# Altium project Analog_Project.PrjPcb (part 2 of 2)
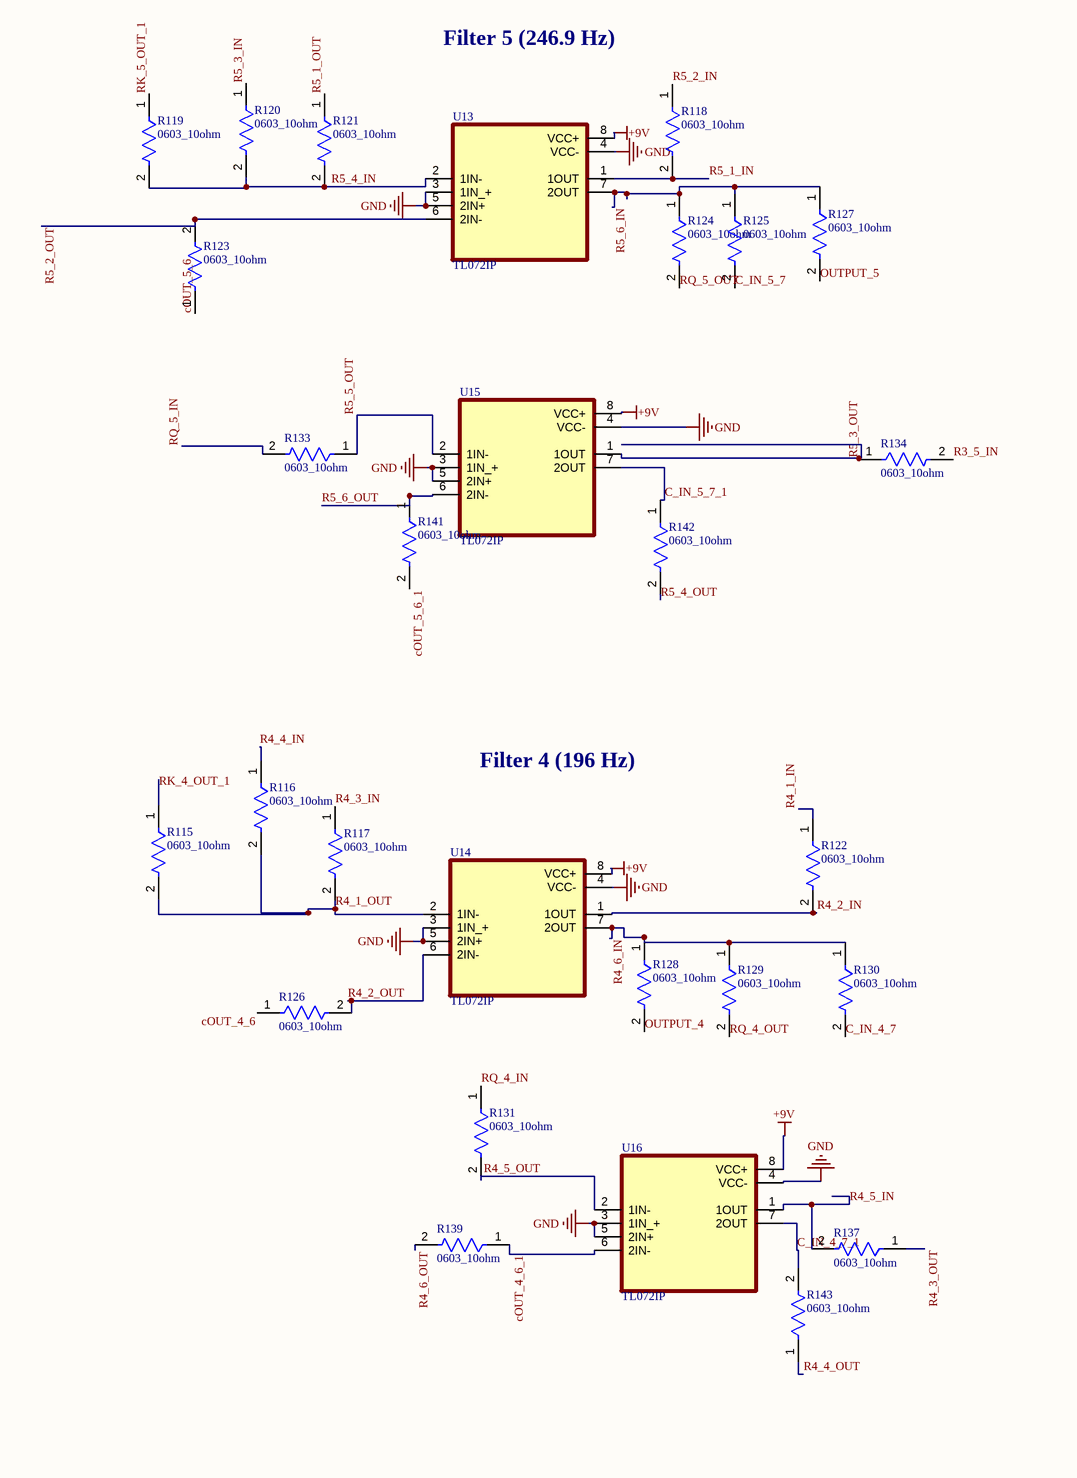
[diagram p6: Sheet1.SchDoc, bottom right]

## Sheet Sheet1.SchDoc (continued)

### Library data of the parts
C1 C15 C30 C31 C36 C76 C77 C82 = CMP-2007-04523-1: Manufacturer: AVX Interconnect / Elco; Part Number: 0805ZG106ZAT2A
C2 = CMP-2007-01614-1: Manufacturer: Vitramon; Part Number: VJ0805G225MXQTW1BC
C3 C4 C19-C21 C24 C26 C27 C32 C33 C37 C39 C40 C65-C67 C70 C72 C73 C78 C79 C83 C85 C86 = CMP-1036-04417-1: CAP 100nF 50V ±5% 0805 (2012 Metric) Thickness 1.45mm SMD; Case-Metric: 2012; Tolerance: Â±5%; Case-EIA: 0805; Max Thickness: 1.45 mm; Rated Voltage: 50 V; Value: 100nF; Technology: SMT
C5-C7 = CMP-2007-03159-1: Manufacturer: Vitramon; Part Number: VJ0805Y103KXAMP
C8 = CMP-03020-034662-1: CAP CER 10UF 10V X7R 0805; Tolerance: 10%; Case/Package: 0805; Ratings: AEC-Q200; Packaging: Tape and Reel; Voltage Rating: 10V; Max Operating Temperature: 125°C; Min Operating Temperature: -55°C; Case Code (Metric): 2012; Case Code (Imperial): 0805; Mount: Surface Mount; RoHS Compliant: Yes
C9-C14 C25 C29 C35 C38 C71 C75 C81 C84 = CMP-2007-01676-1: Manufacturer: Vitramon; Part Number: VJ0805Y105KXQRW1BC
C16 C22 C23 C28 C41 C68 C69 C74 C87 = CMP-2007-04758-1: Manufacturer: AVX Interconnect / Elco; Part Number: 08053C334MAT2A
C17 = CMP-03422-001497-1: CAP CER 22UF 25V X5R 0805; Tolerance: 20%; Max Operating Temperature: 85°C; Dielectric: X5R; Termination: SMD/SMT; Voltage Rating: 25V; Width: 0.049inch; Min Operating Temperature: -55°C; Case/Package: 0805; Lead Free: Lead Free; RoHS Compliant: Yes; Weight: 0.000194oz; Voltage Rating (DC): 25V; Length: 0.079inch; Halogen Free: Halogen Free; Height: 1.25mm; Packaging: Tape and Reel; Package Quantity: 3000; Case Code (Metric): 2012; Thickness: 0.057inch; Case Code (Imperial): 0805; Mount: Surface Mount
C18 = CMP-06035-033356-1: Chip Multilayer Ceramic Capacitors for General Purpose, 0805, 100uF, X5R, 15%, 20%, 4V; Length: 0.079inch; Voltage Rating (DC): 4V; Min Operating Temperature: -55°C; Dielectric: X5R; Case Code (Metric): 2012; Case/Package: 0805; Voltage Rating: 4V; Width: 0.049inch; Case Code (Imperial): 0805; Mount: Surface Mount; Packaging: Tape and Reel; Thickness: 0.057inch; Tolerance: 20%; Max Operating Temperature: 85°C
C34 C80 = CMP-03020-034697-1: CAP CER 22UF 10V X5R 0805; Tolerance: 20%; Dissipation Factor: 10%; Dielectric Material: Ceramic; Termination: Solder; Case Code (Imperial): 0805; Packaging: Tape and Reel; Height: 1.25mm; Voltage: 10V; Case Code (Metric): 2012; Case/Package: 0805; Width: 0.049inch; Capacitance: 22uF; Length: 0.079inch; Depth: 1.25mm; RoHS Compliant: Yes; Voltage Rating (DC): 10V; Lead Free: Lead Free; Dielectric: X5R; Thickness: 0.055inch; Mount: Surface Mount; Voltage Rating: 10V; Max Operating Temperature: 85°C; Min Operating Temperature: -55°C
D1 D2 = CMP-22017-000030-1: LED RED CLEAR CHIP SMD; Forward Current: 30mA; Test Current: 10mA; Number of Elements: 1; Viewing Angle: 130°; Dominant Wavelength: 621nm; Forward Voltage: 2V; Lens Style: Diffused; Power Rating: 100mW; Reverse Voltage: 5V; Wavelength: 630nm; Luminous Intensity: 6mcd; Lens Color: Colorless; Case/Package: 1206; Case Code (Imperial): 1206; Package Quantity: 1; Lead Free: Lead Free; Case Code (Metric): 3216; Height: 1.1mm; Lens Transparency: Clear; Mount: Surface Mount; Depth: 1.6mm; Number of LEDs: 1; Power Dissipation: 100mW; Max Operating Temperature: 85°C; Width: 1.6mm; Color: Red; Number of Pins: 2; Min Operating Temperature: -55°C; Packaging: Tape and Reel; Radiation Hardening: No; Illumination Color: Red; Length: 3.2mm
M1 = CMA-4544PF-W: CMA Series 10V 0.5mA 20 kHz -44 dB Omnidirectional Electret Condenser Microphone; Manufacturer: Same Sky; Frequency: 20Hz; Clock Frequency: 20kHz; Operating Supply Voltage: 3V; Shape: Round; Manufacturer Part Number: CMA-4544PF-W; RoHS: Compliant; Category: Microphones; Stock: 16795; Pricing: 1=0.76, 10=0.591, 25=0.5372, 50=0.5002, 100=0.466, 300=0.41717, 500=0.3965, 1000=0.37038, 5000=0.31717 (USD); Height: 4.5mm; Length: 9.7mm; Lifecycle Status: Production; Material: Aluminium; REACH SVHC: Yes; Schedule B: 8518100000, 8518100000|8518100000, 8518100000|8518100000|8518100000, 8518100000|8518100000|8518100000|8518100000; Width: 9.7mm; ComponentLink1URL: https://datasheet.octopart.com:443/CMA-4544PF-W-Same-Sky-datasheet-188822394.pdf?src-supplier=Same+Sky; ComponentLink1Description: https://datasheet.octopart.com:443/CMA-4544PF-W-Same-Sky-datasheet-188822394.pdf?src-supplier=Same+Sky; ComponentLink2URL: https://datasheet.octopart.com:443/CMA-4544PF-W-Same-Sky-datasheet-181914474.pdf?src-supplier=Same+Sky; ComponentLink2Description: https://datasheet.octopart.com:443/CMA-4544PF-W-Same-Sky-datasheet-181914474.pdf?src-supplier=Same+Sky; ComponentLink3URL: https://datasheet.octopart.com:443/CMA-4544PF-W-CUI-Devices-datasheet-175923826.pdf?src-supplier=Same+Sky; ComponentLink3Description: https://datasheet.octopart.com:443/CMA-4544PF-W-CUI-Devices-datasheet-175923826.pdf?src-supplier=Same+Sky; ComponentLink4URL: https://datasheet.octopart.com:443/CMA-4544PF-W-CUI-Devices-datasheet-137937379.pdf?src-supplier=Same+Sky; ComponentLink4Description: https://datasheet.octopart.com:443/CMA-4544PF-W-CUI-Devices-datasheet-137937379.pdf?src-supplier=Same+Sky; ComponentLink5URL: https://datasheet.octopart.com:443/CMA-4544PF-W-CUI-Devices-datasheet-180435328.pdf?src-supplier=IHS; ComponentLink5Description: https://datasheet.octopart.com:443/CMA-4544PF-W-CUI-Devices-datasheet-180435328.pdf?src-supplier=IHS; ComponentLink6URL: https://datasheet.octopart.com:443/CMA-4544PF-W-Same-Sky-datasheet-182879608.pdf?src-supplier=Electro+Sonic; ComponentLink6Description: https://datasheet.octopart.com:443/CMA-4544PF-W-Same-Sky-datasheet-182879608.pdf?src-supplier=Electro+Sonic; ComponentLink7URL: https://datasheet.octopart.com:443/CMA-4544PF-W-CUI-Devices-datasheet-175925331.pdf?src-supplier=Master+Electronics; ComponentLink7Description: https://datasheet.octopart.com:443/CMA-4544PF-W-CUI-Devices-datasheet-175925331.pdf?src-supplier=Master+Electronics; ComponentLink8URL: https://datasheet.octopart.com:443/CMA-4544PF-W-CUI-Devices-datasheet-140999806.pdf?src-supplier=Master+Electronics; ComponentLink8Description: https://datasheet.octopart.com:443/CMA-4544PF-W-CUI-Devices-datasheet-140999806.pdf?src-supplier=Master+Electronics; ComponentLink9URL: https://datasheet.octopart.com:443/CMA-4544PF-W-Same-Sky-datasheet-189104441.pdf?src-supplier=Master+Electronics; ComponentLink9Description: https://datasheet.octopart.com:443/CMA-4544PF-W-Same-Sky-datasheet-189104441.pdf?src-supplier=Master+Electronics; ComponentLink10URL: https://datasheet.octopart.com:443/CMA-4544PF-W-Same-Sky-datasheet-188930072.pdf?src-supplier=TME; ComponentLink10Description: https://datasheet.octopart.com:443/CMA-4544PF-W-Same-Sky-datasheet-188930072.pdf?src-supplier=TME; ComponentLink11URL: https://datasheet.octopart.com:443/CMA-4544PF-W-Same-Sky-datasheet-182048849.pdf?src-supplier=Future+Electronics; ComponentLink11Description: https://datasheet.octopart.com:443/CMA-4544PF-W-Same-Sky-datasheet-182048849.pdf?src-supplier=Future+Electronics; ComponentLink12URL: https://datasheet.octopart.com:443/CMA-4544PF-W-Same-Sky-datasheet-182048848.pdf?src-supplier=Future+Electronics; ComponentLink12Description: https://datasheet.octopart.com:443/CMA-4544PF-W-Same-Sky-datasheet-182048848.pdf?src-supplier=Future+Electronics; ComponentLink13URL: https://datasheet.octopart.com:443/CMA-4544PF-W-CUI-Devices-datasheet-175923454.pdf?src-supplier=Future+Electronics; ComponentLink13Description: https://datasheet.octopart.com:443/CMA-4544PF-W-CUI-Devices-datasheet-175923454.pdf?src-supplier=Future+Electronics; ComponentLink14URL: https://datasheet.octopart.com:443/CMA-4544PF-W-CUI-Devices-datasheet-137760582.pdf?src-supplier=Future+Electronics; ComponentLink14Description: https://datasheet.octopart.com:443/CMA-4544PF-W-CUI-Devices-datasheet-137760582.pdf?src-supplier=Future+Electronics; ComponentLink15URL: https://datasheet.octopart.com:443/CMA-4544PF-W-CUI-Devices-datasheet-175926790.pdf?src-supplier=CUI+Devices+SCT; ComponentLink15Description: https://datasheet.octopart.com:443/CMA-4544PF-W-CUI-Devices-datasheet-175926790.pdf?src-supplier=CUI+Devices+SCT; ComponentLink16URL: https://datasheet.octopart.com:443/CMA-4544PF-W-CUI-Devices-datasheet-142347353.pdf?src-supplier=CUI+Devices+SCT; ComponentLink16Description: https://datasheet.octopart.com:443/CMA-4544PF-W-CUI-Devices-datasheet-142347353.pdf?src-supplier=CUI+Devices+SCT; ComponentLink17URL: https://octopart.com:443/opatz8j6/c1?t=lXTnaCcjJwGjcBR-hftqRy46Rm0XxLsNiVavy__U6Sv9v2cYTSAN3huNDAf98VAu5AvB4A7oQptECOdunlRI473nwRPDNjIcP9QfyXloMObQEXlWvliwcxVYZ0ie10Z6b3xxVNtHlF9j9kby0b2q-Z3PBdjhMz5Oecnc5rwo8awUAGyhGSNTa_an9j-CSZlg9mKRNPzHie72iOk2HTJfRE-gt4ZqvqitMWjpM8adYlRukDUUIKWlmNwFUAO_icMCQs-B6wIQahrCGlHJAV658mJU-evG895VWtlhg88QQpN1plDBu3uZGZWonvhDf2Z7wu3LQCCgLaLWLZ_SHgaf8FcMtfLuz5a0z3lrttfA&src-supplier=Compliance+Statements; ComponentLink17Description: https://octopart.com:443/opatz8j6/c1?t=lXTnaCcjJwGjcBR-hftqRy46Rm0XxLsNiVavy__U6Sv9v2cYTSAN3huNDAf98VAu5AvB4A7oQptECOdunlRI473nwRPDNjIcP9QfyXloMObQEXlWvliwcxVYZ0ie10Z6b3xxVNtHlF9j9kby0b2q-Z3PBdjhMz5Oecnc5rwo8awUAGyhGSNTa_an9j-CSZlg9mKRNPzHie72iOk2HTJfRE-gt4ZqvqitMWjpM8adYlRukDUUIKWlmNwFUAO_icMCQs-B6wIQahrCGlHJAV658mJU-evG895VWtlhg88QQpN1plDBu3uZGZWonvhDf2Z7wu3LQCCgLaLWLZ_SHgaf8FcMtfLuz5a0z3lrttfA&src-supplier=Compliance+Statements; ComponentLink18URL: https://octopart.com:443/opatz8j6/c1?t=kWkZtaes5uHxRcrOAlKlgzZGqpa1ooZYYOVTvme1WNYfN9dLNdfTSBuU3M84iRk_JtM0pJ7zax_0ZVXPWEif0j52Rs3irpEsZ3ljYMrf-IhEfsvQye5R1uARtKaduCrUUsNsZV4jfqf8i2tc3PrSqasXOH1aVYZEUUdiVz6e3CNRFUcmZaxfqbAreygekHec4R1uI1PKFxe6qrCBLPnT0BvclppvbHKWNZr6OnePBJevou73ZVKGfL4XB0L-PDlyjv1gZxn3fWEqv3tMGjlY6vD10QTm_79jRkin_v2_Exle31Jck-xuia6s5vwndwAOIATg5QzYHE9teyjBp9pJuxcnFEpyXvQ8kB4&src-supplier=Compliance+Statements; ComponentLink18Description: https://octopart.com:443/opatz8j6/c1?t=kWkZtaes5uHxRcrOAlKlgzZGqpa1ooZYYOVTvme1WNYfN9dLNdfTSBuU3M84iRk_JtM0pJ7zax_0ZVXPWEif0j52Rs3irpEsZ3ljYMrf-IhEfsvQye5R1uARtKaduCrUUsNsZV4jfqf8i2tc3PrSqasXOH1aVYZEUUdiVz6e3CNRFUcmZaxfqbAreygekHec4R1uI1PKFxe6qrCBLPnT0BvclppvbHKWNZr6OnePBJevou73ZVKGfL4XB0L-PDlyjv1gZxn3fWEqv3tMGjlY6vD10QTm_79jRkin_v2_Exle31Jck-xuia6s5vwndwAOIATg5QzYHE9teyjBp9pJuxcnFEpyXvQ8kB4&src-supplier=Compliance+Statements; ComponentLink19URL: https://octopart.com:443/opatz8j6/c1?t=zB4848w0l_8afFW7zcHJsYLSDJs9FRlSORokvXkzydIZPg-j89_T7-vXQlM1Po9cVh_xBli-q6mlqJUm1015BFSGKZ18BJYokSElK9bRobm5dIsO1Pi15VQX_MqqUbHRlJilks5xhCJHveR9musONBuiVbSVtJoZEg8m7zd3I47crcoNZNRCmeYK3hShD5P0utouUZE_4mfv9-oJQ1PEYNG6Sbi76rbU57O_Y9MzOqAV173g8Jv92-Vs-syprqKY_-YDB92_00JmAAOhtMBQegHDhtue3bwvsHg_E6MaZIMbDr9ReXo-UuW8VgUNH9DhP9Zl9yRt6m5aroS5zwzW2W7rwltz_VHH3pePgwU9&src-supplier=Compliance+Statements; ComponentLink19Description: https://octopart.com:443/opatz8j6/c1?t=zB4848w0l_8afFW7zcHJsYLSDJs9FRlSORokvXkzydIZPg-j89_T7-vXQlM1Po9cVh_xBli-q6mlqJUm1015BFSGKZ18BJYokSElK9bRobm5dIsO1Pi15VQX_MqqUbHRlJilks5xhCJHveR9musONBuiVbSVtJoZEg8m7zd3I47crcoNZNRCmeYK3hShD5P0utouUZE_4mfv9-oJQ1PEYNG6Sbi76rbU57O_Y9MzOqAV173g8Jv92-Vs-syprqKY_-YDB92_00JmAAOhtMBQegHDhtue3bwvsHg_E6MaZIMbDr9ReXo-UuW8VgUNH9DhP9Zl9yRt6m5aroS5zwzW2W7rwltz_VHH3pePgwU9&src-supplier=Compliance+Statements; ComponentLink20URL: https://octopart.com:443/opatz8j6/c1?t=k-9ha6ihwXKBIW3Ekh6rGi5_ms99WErdE-2SRh94fCUNSnSBSpXGJCI0mMoXqCncXKsRjkRG45qJSEmJrf5yR2MlANrHF8GkXnP6id2epx-swvw3aEEAGSGgwkOrKv5OVT8CpOS1ErMX6xVuMTNvudkxlXW0wLa6kPdgHpE5ln18RxWEqMPEOyZ4ah-9IeODRzLCIbaXtWVildsr9BPcMSZSWyldyTCf77RfQ_nxa6ysH6gLQurMngrnpwBiPQ4Cte79tTQ6Uq0lydK5GhzG2Ifb0Za08M-K6i8vLc7bSeNT4g1DmfgudckO6b9hhVIl_Ah5PR0QVoY3kX_AzwioxdraA_6mPF_2zZY&src-supplier=Compliance+Statements; ComponentLink20Description: https://octopart.com:443/opatz8j6/c1?t=k-9ha6ihwXKBIW3Ekh6rGi5_ms99WErdE-2SRh94fCUNSnSBSpXGJCI0mMoXqCncXKsRjkRG45qJSEmJrf5yR2MlANrHF8GkXnP6id2epx-swvw3aEEAGSGgwkOrKv5OVT8CpOS1ErMX6xVuMTNvudkxlXW0wLa6kPdgHpE5ln18RxWEqMPEOyZ4ah-9IeODRzLCIbaXtWVildsr9BPcMSZSWyldyTCf77RfQ_nxa6ysH6gLQurMngrnpwBiPQ4Cte79tTQ6Uq0lydK5GhzG2Ifb0Za08M-K6i8vLc7bSeNT4g1DmfgudckO6b9hhVIl_Ah5PR0QVoY3kX_AzwioxdraA_6mPF_2zZY&src-supplier=Compliance+Statements; Supplier Part Number: 102-1721-ND; Supplier: DigiKey
P2 P3 = CMP-1024-00105-1: Modified .025" SQ Post Header, Through-hole, Vertical, -55 to 105 degC, 2.54 mm Pitch, 4-Pin, Male, RoHS; Manufacturer: Samtec; Pitch: 2.54 mm; PartNumber: MTSW-104-07-T-S-170; ComponentLink3Description: Package Specification; ComponentLink2URL: http://www.samtec.com/documents/webfiles/pdf/MTSW.PDF; Temperature Range: -55 to 105 degC; DatasheetVersion: F-214; ComponentLink3URL: http://www.samtec.com/documents/webfiles/cpdf/MTSW-XXX-XX-X-X-XXXX-XX-XXX-MKT1.pdf; Orientation: Vertical; ComponentLink1URL: http://www.samtec.com; RoHS: True; PackageReference: MTSW-104-07-X-S-170; ComponentLink1Description: Manufacturer URL; Mounting Technology: Through-hole; PackageDescription: Assembly .025" [.64] SQ Post Terminal Strip; PackageVersion: BI, 2/1987; ComponentLink2Description: Datasheet
R1-R6 R9-R14 R41 R43 = CMP-03412-037341-1: RES SMD 330 OHM 1% 1/8W 0805; Manufacturer: Yageo; Tolerance: 0.01; Value: 330Ω; Automotive Grade: Grade 0; Voltage Rating: 150V; ComponentLink2URL: http://www.yageo.com/documents/recent/PYu-AC_51_RoHS_L_6.pdf; Power Rating: 1/8W; Height: 0.6mm; Automotive: Yes; Mouser Description: Thick Film Resistors - SMD 1/8W 330ohm 1% AEC-Q200; Manufacturer Part Number: AC0805FR-07330RL; Composition: Thick Film; Category: Res; ComponentLink2Description: Datasheet; Temperature Range Low: -55°C; Ipc Land Pattern Name: RESC200125X50; RoHS: TRUE; Lead Free: Yes; Digikey Description: RES SMD 330 OHM 1% 1/8W 0805; Temperature Range High: +155°C; Device Class L1: Passive Components; Octopart: https://octopart.com/ac0805fr-07330rl-yageo-51059920; Footprint Url: http://www.yageo.com/exep/pages/download/literatures/PYu-R_Mount_10.pdf; Device Class L3: Chip SMD Resistors; Series: AC; Temperature: -55°C to +155°C; Package: AC0805; Device Class L2: Resistors; Resistance: 330Ω
R7 = PV36W104C01B00: Cermet trimmer potentiometer, 25 turns, 100 kΩ, 0.5 W, THT, on top, PV36W104C01B00; Manufacturer: Bourns; Lead Diameter: 510µm; Lead Length: 6.4mm; Max Power Dissipation: 500mW; Number of Turns: 25; Value: 100kΩ; Temperature Coefficient: 100ppm/°C; Tolerance: 10%; Supplier: DigiKey; Supplier Part Number: 118-PV36W104C01B00-ND; Manufacturer Part Number: PV36W104C01B00; RoHS: Compliant; Category: Variable Resistors and Potentiometers; Stock: 108942; Pricing: 1=1.53, 10=1.291, 25=1.2048, 50=1.1432, 100=1.0844, 250=1.01108, 500=0.95864, 1000=0.90877, 5000=0.80229 (USD); Case/Package: Radial; Composition: Cermet; Contact Plating: Tin; Height: 10.03mm; Lifecycle Status: Production; Max Operating Temperature: 125°C; Min Operating Temperature: -55°C; Mounting Technology: Through Hole; Number of Terminals: 3; Power Dissipation: 500mW; REACH SVHC: No; Schedule B: 8533400080, 8533400080|8533400080|8533400080|8533400080|8533400080; Termination: PC Pins; Width: 4.83mm; ComponentLink1URL: https://datasheet.octopart.com:443/PV36W104C01B00-Bourns-datasheet-182141976.pdf?src-supplier=IHS; ComponentLink1Description: https://datasheet.octopart.com:443/PV36W104C01B00-Bourns-datasheet-182141976.pdf?src-supplier=IHS; ComponentLink2URL: https://datasheet.octopart.com:443/PV36W104C01B00-Bourns-datasheet-154729827.pdf?src-supplier=Electro+Sonic; ComponentLink2Description: https://datasheet.octopart.com:443/PV36W104C01B00-Bourns-datasheet-154729827.pdf?src-supplier=Electro+Sonic; ComponentLink3URL: https://datasheet.octopart.com:443/PV36W104C01B00-Bourns-datasheet-177040424.pdf?src-supplier=Burklin+Elektronik; ComponentLink3Description: https://datasheet.octopart.com:443/PV36W104C01B00-Bourns-datasheet-177040424.pdf?src-supplier=Burklin+Elektronik; ComponentLink4URL: https://datasheet.octopart.com:443/PV36W104C01B00-Bourns-datasheet-165058412.pdf?src-supplier=Burklin+Elektronik; ComponentLink4Description: https://datasheet.octopart.com:443/PV36W104C01B00-Bourns-datasheet-165058412.pdf?src-supplier=Burklin+Elektronik; ComponentLink5URL: https://datasheet.octopart.com:443/PV36W104C01B00-Bourns-datasheet-142044744.pdf?src-supplier=RS+(Formerly+Allied+Electronics); ComponentLink5Description: https://datasheet.octopart.com:443/PV36W104C01B00-Bourns-datasheet-142044744.pdf?src-supplier=RS+(Formerly+Allied+Electronics); ComponentLink6URL: https://datasheet.octopart.com:443/PV36W104C01B00-Bourns-datasheet-103142593.pdf?src-supplier=TME; ComponentLink6Description: https://datasheet.octopart.com:443/PV36W104C01B00-Bourns-datasheet-103142593.pdf?src-supplier=TME; ComponentLink7URL: https://datasheet.octopart.com:443/PV36W104C01B00-Bourns-datasheet-12516445.pdf?src-supplier=X-ON; ComponentLink7Description: https://datasheet.octopart.com:443/PV36W104C01B00-Bourns-datasheet-12516445.pdf?src-supplier=X-ON; ComponentLink8URL: http://sigma.octopart.com:80/conflict_mineral_statement/Bourns-company-36.pdf?src-supplier=Compliance+Statements; ComponentLink8Description: http://sigma.octopart.com:80/conflict_mineral_statement/Bourns-company-36.pdf?src-supplier=Compliance+Statements
R8 = CMP-26527-006269-1: 21kΩ ±1% 0.125W 0805 Thick Film Chip Resistor AEC-Q200 compliant; Max Power Dissipation: 125mW; Temperature Coefficient: 100ppm/°C; Length: 0.079inch; Resistor Type: Thick Film; Width: 0.049inch; Series: RMCF; Features: Automotive AEC-Q200; RoHS Compliant: Yes; Packaging: Tape and Reel; Contact Plating: Tin; Case/Package: 0805; Case Code (Imperial): 0805; Height: 0.026inch; Min Operating Temperature: -55°C; Max Operating Temperature: 155°C; Package Quantity: 10000; Case Code (Metric): 2012; Tolerance: 1%; Radiation Hardening: No; Number of Terminations: 2; Mount: Surface Mount
R15 R38 = CMP-26527-004125-1: 330Ω ±5% 0.125W 0805 Thick Film Chip Resistor AEC-Q200 compliant; Power Rating: 125mW; Temperature Coefficient: 200ppm/°C; RoHS Compliant: Yes; Case Code (Imperial): 0805; Features: Automotive AEC-Q200; Mount: Surface Mount; Length: 2mm; Case Code (Metric): 2012; Series: RMCF; Construction: Rectangular; Radiation Hardening: No; Tolerance: 5%; Depth: 1.25mm; Military Standard: Not; Resistor Type: Thick Film; Min Operating Temperature: -55°C; Lead Free: Lead Free; Max Operating Temperature: 155°C; Number of Terminations: 2; Contact Plating: Tin; Width: 0.049inch; Height: 0.026inch; Size Code: 0805; Case/Package: 0805; Max Power Dissipation: 125mW; Packaging: Tape and Reel
R16 R17 = CMP-02407-000241-1: RES 1.05K OHM 0.5% 1/5W 0805; Power Rating: 200mW; Tolerance: 0.1%; Voltage Rating: 150V; Height: 0.52mm; Min Operating Temperature: -55°C; Packaging: Tape and Reel; Case Code (Imperial): 0805; Case/Package: 0805; Case Code (Metric): 2012; Weight: 0.000162oz; Width: 1.25mm; Length: 2mm; Max Operating Temperature: 155°C; Composition: Thin Film
R18-R23 = PV36W102C01B00: Cermet trimmer potentiometer, 25 turns, 1 kΩ, 0.5 W, THT, on top, PV36W102C01B00; Manufacturer: Bourns; Lead Diameter: 510µm; Lead Length: 6.4mm; Max Power Dissipation: 500mW; Number of Turns: 25; Value: 1kΩ; Temperature Coefficient: 100ppm/°C; Tolerance: 10%; Supplier: DigiKey; Supplier Part Number: 118-PV36W102C01B00-ND; Manufacturer Part Number: PV36W102C01B00; RoHS: Compliant; Category: Variable Resistors and Potentiometers; Stock: 7425; Pricing: 1=1.53, 10=1.291, 25=1.2048, 50=1.1432, 100=1.0844, 250=1.01108, 500=0.95864, 1000=0.90877, 5000=0.80229 (USD); Case/Package: Radial; Composition: Cermet; Height: 10.03mm; Lifecycle Status: Production; Max Operating Temperature: 125°C; Min Operating Temperature: -55°C; Mounting Technology: Through Hole; Number of Terminals: 3; Power Dissipation: 500mW; Power Rating: 500mW; REACH SVHC: No; Schedule B: 8533400080, 8533400080|8533400080|8533400080|8533400080|8533400080; Termination: PC Pins; Width: 4.83mm; ComponentLink1URL: https://datasheet.octopart.com:443/PV36W102C01B00-Bourns-datasheet-182141976.pdf?src-supplier=JRH+Electronics; ComponentLink1Description: https://datasheet.octopart.com:443/PV36W102C01B00-Bourns-datasheet-182141976.pdf?src-supplier=JRH+Electronics; ComponentLink2URL: https://datasheet.octopart.com:443/PV36W102C01B00-Bourns-datasheet-154729827.pdf?src-supplier=Electro+Sonic; ComponentLink2Description: https://datasheet.octopart.com:443/PV36W102C01B00-Bourns-datasheet-154729827.pdf?src-supplier=Electro+Sonic; ComponentLink3URL: https://datasheet.octopart.com:443/PV36W102C01B00-Bourns-datasheet-177040424.pdf?src-supplier=Burklin+Elektronik; ComponentLink3Description: https://datasheet.octopart.com:443/PV36W102C01B00-Bourns-datasheet-177040424.pdf?src-supplier=Burklin+Elektronik; ComponentLink4URL: https://datasheet.octopart.com:443/PV36W102C01B00-Bourns-datasheet-165058412.pdf?src-supplier=Burklin+Elektronik; ComponentLink4Description: https://datasheet.octopart.com:443/PV36W102C01B00-Bourns-datasheet-165058412.pdf?src-supplier=Burklin+Elektronik; ComponentLink5URL: https://datasheet.octopart.com:443/PV36W102C01B00-Bourns-datasheet-103142593.pdf?src-supplier=TME; ComponentLink5Description: https://datasheet.octopart.com:443/PV36W102C01B00-Bourns-datasheet-103142593.pdf?src-supplier=TME; ComponentLink6URL: http://sigma.octopart.com:80/conflict_mineral_statement/Bourns-company-36.pdf?src-supplier=Compliance+Statements; ComponentLink6Description: http://sigma.octopart.com:80/conflict_mineral_statement/Bourns-company-36.pdf?src-supplier=Compliance+Statements
R24 R25 R28 R29 R34 R39 R42 R49 R54-R56 R58 R61 R68 R75 R76 R157-R180 R207 R208 = CMP-03211-006861-1: CRGP 0805 10K 1%; Manufacturer: TE; Power Rating: 0.33W; Voltage Rating: 150V; Tolerance: 0.01; Temperature Coefficient: ±100ppm/°C; Manufacturer Part Number: CRGP0805F10K; ComponentLink2URL: https://www.mouser.com/datasheet/2/418/NG_DS_9-1773463-9_A-1358566.pdf; Temperature Range Low: -55°C; Ipc Land Pattern Name: RESC200125X55; Device Class L2: Resistors; Automotive: No; Device Class L3: Chip SMD Resistors; Composition: Thick Film; Temperature Range High: +155°C; Temperature: -55°C to +155°C; Height: 0.65mm; Series: CRGP; RoHS: TRUE; Device Class L1: Passive Components; Octopart: https://octopart.com/crgp0805f10k-te+connectivity-91018782; Package: CRGP0805; Digikey Description: CRGP 0805 10K 1%; Ambient Temperature Range High: +70°C; Lead Free: Yes; ComponentLink2Description: Datasheet; Category: Res; Resistance: 10KΩ
R26 R31 R33 R44 R63 R64 R67 R69 R70 = CMP-03211-000816-1: CRGCQ 0805 100K 1%; Manufacturer: TE Connectivity; Tolerance: 0.01; Power Rating: 0.125W; Temperature Coefficient: ±100ppm/°C; Voltage Rating: 150V; RoHS: TRUE; ComponentLink2URL: https://www.te.com/commerce/DocumentDelivery/DDEController?Action=showdoc&DocId=Data+Sheet%7F1773204-3%7F1%7Fpdf%7FEnglish%7FENG_DS_1773204-3_1.pdf%7F4-2176341-1150; Category: Res; Device Class L2: Resistors; Height: 0.65mm; Ambient Temperature Range High: +70°C; Ipc Land Pattern Name: RESC200125X55; Octopart: https://octopart.com/crgcq0805f100k-te+connectivity-91018138; Digikey Description: CRGCQ 0805 100K 1%; Temperature Range High: +155°C; Lead Free: Yes; Resistance: 100KΩ; Automotive: Yes; Temperature Range Low: -55°C; Device Class L1: Passive Components; Device Class L3: Chip SMD Resistors; Mouser Description: Res Thick Film 0805 100K Ohm 1% 0.125W(1/8W) ±100ppm/C Pad SMD Automotive T/R; Temperature: -55°C to +155°C; Composition: Thick Film; ComponentLink2Description: Datasheet; Automotive Grade: Grade 1141; Package: CRGCQ0805; Manufacturer Part Number: CRGCQ0805F100K; Series: CRGCQ
R27 = CMP-02408-000037-1: Res Wirewound 12K Ohm 1% 3W ±20ppm/°C Ceramic Hi Temp Sil AXL Thru-Hole Bulk; Resistance: 12kR; Lead Diameter: 0.81mm; Resistor Type: Wirewound; Case/Package: Ceramic; Contact Plating: Tin; Diameter: 4.75mm; Length: 14.22mm; Min Operating Temperature: -65°C; Lead Free: Lead Free; Tolerance: 1%; Power Rating: 3W; Termination: Axial; RoHS Compliant: Yes; Series: RS; Package Quantity: 100; Width: 4.75mm; Temperature Coefficient: 20ppm/°C; Mount: Through Hole; Weight: 0.024692oz; Max Operating Temperature: 250°C
R30 = CMP-26527-005543-1: 1.2kΩ ±5% 0.125W 0805 Thick Film Chip Resistor AEC-Q200 compliant; Temperature Coefficient: 200ppm/°C; Max Power Dissipation: 125mW; RoHS Compliant: Yes; Width: 0.049inch; Max Operating Temperature: 155°C; Features: Automotive AEC-Q200; Contact Plating: Tin; Series: RMCF; Height: 0.026inch; Radiation Hardening: No; Packaging: Tape and Reel; Number of Terminations: 2; Length: 0.079inch; Min Operating Temperature: -55°C; Resistor Type: Thick Film; Case/Package: 0805; Tolerance: 5%; Mount: Surface Mount
R32 = CMP-03211-007232-1: CRGP0805 470KΩ 0.33W ±100ppm/°C 1% 150V; Manufacturer: TE; Tolerance: 0.01; Temperature Range High: +155°C; ComponentLink2Description: Datasheet; Composition: Thick Film; Automotive: No; Octopart: https://octopart.com/crgp0805f470k-te+connectivity-91018821; Ipc Land Pattern Name: RESC200125X55; Ambient Temperature Range High: +70°C; RoHS: TRUE; Height: 0.65mm; Temperature Range Low: -55°C; Manufacturer Part Number: CRGP0805F470K; Power Rating: 0.33W; Category: Res; Package: CRGP0805; Device Class L3: Chip SMD Resistors; Voltage Rating: 150V; ComponentLink2URL: https://www.mouser.com/datasheet/2/418/NG_DS_9-1773463-9_A-1358566.pdf; Temperature: -55°C to +155°C; Device Class L2: Resistors; Lead Free: Yes; Device Class L1: Passive Components; Series: CRGP; Resistance: 470KΩ; Temperature Coefficient: ±100ppm/°C
R35 = CMP-02407-001466-1: RES 1.05K OHM 0.5% 1/5W 0805; Max Power Dissipation: 125mW; Tolerance: 0.1%; Temperature Coefficient: 25ppm/°C; Resistance: 4.7kR; Composition: Thin Film; Case/Package: 0805; Lead Free: Lead Free; Min Operating Temperature: -55°C; Package Quantity: 5000; Packaging: Tape and Reel; Width: 0.049inch; Height: 0.022inch; Depth: 1.25mm; Number of Terminations: 2; Military Standard: Not; Max Operating Temperature: 125°C; Length: 0.079inch
R36 = CMP-03412-037656-1: RES SMD 820 OHM 1% 1/8W 0805; Manufacturer: Yageo; Voltage Rating: 150V; Tolerance: 0.01; Automotive Grade: Grade 0; Category: Res; Temperature Range Low: -55°C; Lead Free: Yes; Composition: Thick Film; Device Class L1: Passive Components; ComponentLink2URL: http://www.yageo.com/documents/recent/PYu-AC_51_RoHS_L_6.pdf; Ipc Land Pattern Name: RESC200125X50; Series: AC; Package: AC0805; Device Class L2: Resistors; Octopart: https://octopart.com/ac0805fr-07820rl-yageo-26041182; RoHS: TRUE; Temperature Range High: +155°C; Automotive: Yes; Mouser Description: Thick Film Resistors - SMD 1/8W 820ohm 1% AEC-Q200; ComponentLink2Description: Datasheet; Digikey Description: RES SMD 820 OHM 1% 1/8W 0805; Power Rating: 1/8W; Height: 0.6mm; Manufacturer Part Number: AC0805FR-07820RL; Footprint Url: http://www.yageo.com/exep/pages/download/literatures/PYu-R_Mount_10.pdf; Temperature: -55°C to +155°C; Resistance: 820Ω; Device Class L3: Chip SMD Resistors
R37 R40 = CMP-02407-000077-1: RES 1.05K OHM 0.5% 1/5W 0805; Tolerance: 0.1%; Max Power Dissipation: 125mW; Temperature Coefficient: 25ppm/°C; Package Quantity: 5000; Min Operating Temperature: -55°C; Radiation Hardening: No; Number of Terminations: 2; Width: 0.049inch; Max Operating Temperature: 125°C; Lead Free: Lead Free; Case/Package: 0805; Length: 0.079inch; Composition: Thin Film; Packaging: Tape and Reel; Contact Plating: Tin; Height: 0.022inch; Depth: 1.25mm; Military Standard: Not
R45 = CMP-02407-002941-1: RES 1.05K OHM 0.5% 1/5W 0805; Temperature Coefficient: 50ppm/°C; Max Power Dissipation: 200mW; Resistance: 120kR; Tolerance: 1%; Contact Plating: Tin; Min Operating Temperature: -55°C; Packaging: Tape and Reel; Number of Terminations: 2; Height: 0.022inch; Width: 0.049inch; Lead Free: Lead Free; Length: 0.079inch; Radiation Hardening: No; Case/Package: 0805; Composition: Thin Film; Package Quantity: 5000; Max Operating Temperature: 155°C
R46 = CMP-04015-058936-1: 1.2kΩ ±0.1% 0.125W, 1/8W Chip Resistor 0805 (2012 Metric) Moisture Resistant Thin Film
R47 R62 R193-R196 = CMP-26527-001228-1: 820Ω ±5% 0.125W 0805 Thick Film Chip Resistor AEC-Q200 compliant; Temperature Coefficient: 200ppm/°C; Max Power Dissipation: 125mW; Resistance: 820R; Height: 0.026inch; Tolerance: 5%; Mount: Surface Mount; Packaging: Tape and Reel; RoHS Compliant: Yes; Case/Package: 0805; Series: RMCF; Case Code (Imperial): 0805; Width: 0.049inch; Construction: Rectangular; Case Code (Metric): 2012; Length: 0.079inch; Depth: 1.25mm; Min Operating Temperature: -55°C; Number of Terminations: 2; Features: Automotive AEC-Q200; Max Operating Temperature: 155°C; Contact Plating: Tin; Resistor Type: Thick Film; Military Standard: Not; Radiation Hardening: No
R48 R52 R78 R79 R81 R181-R192 R197-R202 = CMP-04015-009324-1: 21kΩ ±0.1% 0.125W, 1/8W Chip Resistor 0805 (2012 Metric) Moisture Resistant Thin Film
R50 R59 R77 R209 = CMP-2001-04239-1: Manufacturer: Vishay Dale; Part Number: CRCW08055K00FKTA
R51 R66 = CMP-03412-037776-1: RES SMD 270K OHM 1% 1/8W 0805; Manufacturer: Yageo; Resistance: 270KΩ; Automotive Grade: Grade 0; Value: 270KΩ; Tolerance: 0.01; Voltage Rating: 150V; Digikey Description: RES SMD 270K OHM 1% 1/8W 0805; Height: 0.6mm; Ipc Land Pattern Name: RESC200125X50; RoHS: TRUE; Power Rating: 1/8W; Octopart: https://octopart.com/ac0805fr-07270kl-yageo-71367641; Temperature: -55°C to +155°C; Lead Free: Yes; Device Class L1: Passive Components; Temperature Range High: +155°C; Series: AC; Temperature Range Low: -55°C; Manufacturer Part Number: AC0805FR-07270KL; Automotive: Yes; Composition: Thick Film; Device Class L2: Resistors; Footprint Url: http://www.yageo.com/exep/pages/download/literatures/PYu-R_Mount_10.pdf; ComponentLink2Description: Datasheet; Device Class L3: Chip SMD Resistors; ComponentLink2URL: http://www.yageo.com/documents/recent/PYu-AC_51_RoHS_L_6.pdf; Package: AC0805; Mouser Description: Thick Film Resistors - SMD 1/8W 270K ohm 1% AEC-Q200; Category: Res
R53 = CMP-02407-009076-1: RES 1.05K OHM 0.5% 1/5W 0805
R57 R73 R203-R206 = CMP-26527-006932-1: 220Ω ±5% 0.125W 0805 Thick Film Chip Resistor AEC-Q200 compliant; Resistance: 220R; Max Power Dissipation: 125mW; Temperature Coefficient: 200ppm/°C; Min Operating Temperature: -55°C; Max Operating Temperature: 155°C; Military Standard: Not; Resistor Type: Thick Film; Radiation Hardening: No; Length: 0.079inch; Contact Plating: Tin; Number of Terminations: 2; Depth: 1.25mm; Construction: Rectangular; Width: 0.049inch; Case/Package: 0805; Case Code (Metric): 2012; Tolerance: 5%; Packaging: Tape and Reel; Lead Free: Lead Free; Series: RMCF; RoHS Compliant: Yes; Mount: Surface Mount; Case Code (Imperial): 0805; Features: Automotive AEC-Q200; Height: 0.026inch
R60 = CMP-03412-037512-1: RES SMD 390K OHM 1% 1/8W 0805; Manufacturer: Yageo; Voltage Rating: 150V; Tolerance: 0.01; Resistance: 390KΩ; Value: 390KΩ; Automotive Grade: Grade 0; Temperature: -55°C to +155°C; Series: AC; Device Class L2: Resistors; Category: Res; Power Rating: 1/8W; Manufacturer Part Number: AC0805FR-07390KL; Height: 0.6mm; Temperature Range Low: -55°C; ComponentLink2Description: Datasheet; Automotive: Yes; Ipc Land Pattern Name: RESC200125X50; Digikey Description: RES SMD 390K OHM 1% 1/8W 0805; Octopart: https://octopart.com/ac0805fr-07390kl-yageo-26041164; Device Class L1: Passive Components; Package: AC0805; Footprint Url: http://www.yageo.com/exep/pages/download/literatures/PYu-R_Mount_10.pdf; RoHS: TRUE; Device Class L3: Chip SMD Resistors; Composition: Thick Film; Temperature Range High: +155°C; Lead Free: Yes; ComponentLink2URL: http://www.yageo.com/documents/recent/PYu-AC_51_RoHS_L_6.pdf
R65 R71 R72 = CMP-03211-007273-1: CRGCQ0805 330KΩ 0.125W ±100ppm/°C 1% 150V; Manufacturer: TE Connectivity; Tolerance: 0.01; Temperature: -55°C to +155°C; Octopart: https://octopart.com/crgcq0805f330k-te+connectivity-91018169; Automotive Grade: Grade 1255; Temperature Range Low: -55°C; Temperature Range High: +155°C; Power Rating: 0.125W; Temperature Coefficient: ±100ppm/°C; ComponentLink2URL: https://www.te.com/commerce/DocumentDelivery/DDEController?Action=showdoc&DocId=Data+Sheet%7F1773204-3%7F1%7Fpdf%7FEnglish%7FENG_DS_1773204-3_1.pdf%7F4-2176341-1264; Ambient Temperature Range High: +70°C; Value: 330KΩ; ComponentLink2Description: Datasheet; Composition: Thick Film; Lead Free: Yes; Ipc Land Pattern Name: RESC200125X55; Series: CRGCQ; Package: CRGCQ0805; Category: Res; Device Class L2: Resistors; Resistance: 330KΩ; Height: 0.65mm; Device Class L1: Passive Components; Device Class L3: Chip SMD Resistors; Voltage Rating: 150V; Manufacturer Part Number: CRGCQ0805F330K; RoHS: TRUE; Automotive: Yes
R80 = CMP-08839-016847-1: Thick Film Chip Resistor, 0805, 1.2kΩ, 5%, 200ppm/°C, 0.125W, 150V; Resistance: 1.2kR; Max Power Dissipation: 125mW; Series: MCR10; Voltage Rating (DC): 150V; Features: Automotive AEC-Q200; Length: 0.079inch; Width: 0.049inch; Tolerance: 5%; Packaging: Tape and Reel; Package Quantity: 5000; Height: 0.024inch; Lead Free: Lead Free; Temperature Coefficient: 200ppm/°C; Resistor Type: Thick Film; Case/Package: 0805; RoHS Compliant: Yes; Number of Terminations: 2; Case Code (Imperial): 0805; Case Code (Metric): 2012
R82-R156 = CMP-02407-011165-1: RES SMD 100 OHM 1% 1/8W 0603; Temperature Coefficient: 25ppm/°C; Resistance: 20kR; Power Rating: 125mW; Tolerance: 0.1%; Voltage Rating: 75V; Length: 1.55mm; Case Code (Imperial): 0603; Case/Package: 0603; Construction: Rectangular; Package Quantity: 1000; Number of Terminations: 2; Termination: SMD/SMT; Resistor Type: Thin Film; Features: Automotive AEC-Q200; Series: MCT 0603 - Precision; Max Operating Temperature: 155°C; Depth: 0.85mm; Max Power Dissipation: 125mW; Min Operating Temperature: -55°C; Width: 0.033inch; Case Code (Metric): 1608; Packaging: Tape and Reel; Weight: 6.7E-05oz; Military Standard: Not; Height: 0.022inch
U1 U5 = CMP-04895-000025-1: IC OPAMP GP 2 CIRCUIT 8DIP; Manufacturer: Texas Instruments; Max Supply Voltage: 32V; Input Bias Current: 0.045uA; Nominal Supply Current: 0.5-1mA; Min Supply Voltage: 3V; Voltage Gain: 100V/mV; Standoff Height: 0.51mm; Number Of Channels: 2; Max Dual Supply Voltage: 16V; Input Offset Voltage: 2mV; Output Current Per Channel: 20mA; Min Dual Supply Voltage: 1.5V; Gain Bandwidth: 1MHz; Automotive: No; Device Class L2: Linear ICs; Device Class L1: Integrated Circuits (ICs); ComponentLink2URL: http://www.ti.com/lit/ds/symlink/lm358-n.pdf; Temperature Range Low: 0°C; Mouser Description: Operational Amplifiers - Op Amps LOW PWR DUAL OP AMP; Lead Free: Yes; Height: 5.08mm; Category: IC; Ipc Land Pattern Name: DIP794W46P254L1016H508Q8; Temperature: 0°C to +70°C; RoHS: TRUE; Temperature Range High: +70°C; Package: P0008A; Digikey Description: IC OPAMP GP 2 CIRCUIT 8DIP; ComponentLink2Description: Datasheet; Manufacturer Part Number: LM358AN/NOPB; Octopart: https://octopart.com/lm358an%2Fnopb-texas+instruments-24814014; Device Class L3: Amplifiers - Op Amps
U2 = CMP-0063-00095-2: Frequency to Voltage Converter, 14-pin MDIP; Manufacturer: National Semiconductor; CompType: MiscPower; PackageTopMarking: NSUZXYYTTE#*LM2917N; PowerWise: N; ComponentLink3Description: N14A Package Page; RevisionNote: Component URLs added; ComponentLink2URL: http://www.national.com/pf/LM/LM2917.html; Code_JEDEC: MS-001-AA; ComponentLink1URL: http://www.national.com/ds/LM/LM2917.pdf; DatasheetVersion: Dec-2008; PackageVersion: revG, May-2006; ComponentLink3URL: http://www.national.com/packaging/folders/n14a.html; ComponentLink2Description: LM2917 Web Page; PackageReference: N14A; RoHS: N; PinCount: 14; PackageDescription: MDIP, .750 x .250 x.130in, 14 Lead, .100in Pitch; ComponentLink1Description: LM2917 Datasheet
U3 = CMP-1305-00017-1: Low Offset Voltage Dual Comparators, 2 to 36 V, 0 to 70 degC, 8-Pin PDIP, Pb-Free, Tube; Manufacturer: On Semiconductor; ICC Typ (mA): 0.4; VCC Min (V): 2; IO Typ (mA): 16; VCC Max (V): 36; ComponentLink2Description: Datasheet; PackageDescription: 8-Pin Plastic Dual-In Line Package, Body 9.52 x 6.605 mm, Pitch 2.54 mm; RoHS: TRUE; DatasheetVersion: Rev. 25; PackageVersion: Rev. M, 04/2010; PackageReference: PDIP-8-626-05; ComponentLink1Description: Manufacturer URL; ComponentLink1URL: http://www.onsemi.com/; Packing: Tube; ComponentLink3URL: http://www.onsemi.com/pub_link/Collateral/LM211-D.PDF; ComponentLink3Description: Package Specification; PartNumber: LM393NG; ComponentLink2URL: http://www.onsemi.com/pub_link/Collateral/LM393-D.PDF; Mounting Technology: Through Hole
U4 = KSC1845FTA: No Description Available; Manufacturer_Name: onsemi; Copyright: Copyright (C) 2025 Ultra Librarian. All rights reserved.; Manufacturer_Part_Number: KSC1845FTA; RefDes: RefDes; Type: Type
U6 = LM393N: Comparator General Purpose CMOS, DTL, ECL, MOS, Open-Collector, TTL 8-PDIP; MF: Texas Instruments; SnapEDA_Link: https://www.snapeda.com/parts/LM393N/Texas+Instruments/view-part/?ref=snap; Package: PDIP-8 Texas; Value: *; MP: LM393N; Check_prices: https://www.snapeda.com/parts/LM393N/Texas+Instruments/view-part/?ref=eda
U7-U18 = TL072IP: Dual, 30-V, 3-MHz, high slew rate (13-V/Âµs), In to V+, JFET-input op amp; MF: Texas Instruments; SnapEDA_Link: https://www.snapeda.com/parts/TL072IP/Texas+Instruments/view-part/?ref=snap; Package: PDIP-8 Texas; Value: *; MP: TL072IP; Check_prices: https://www.snapeda.com/parts/TL072IP/Texas+Instruments/view-part/?ref=eda